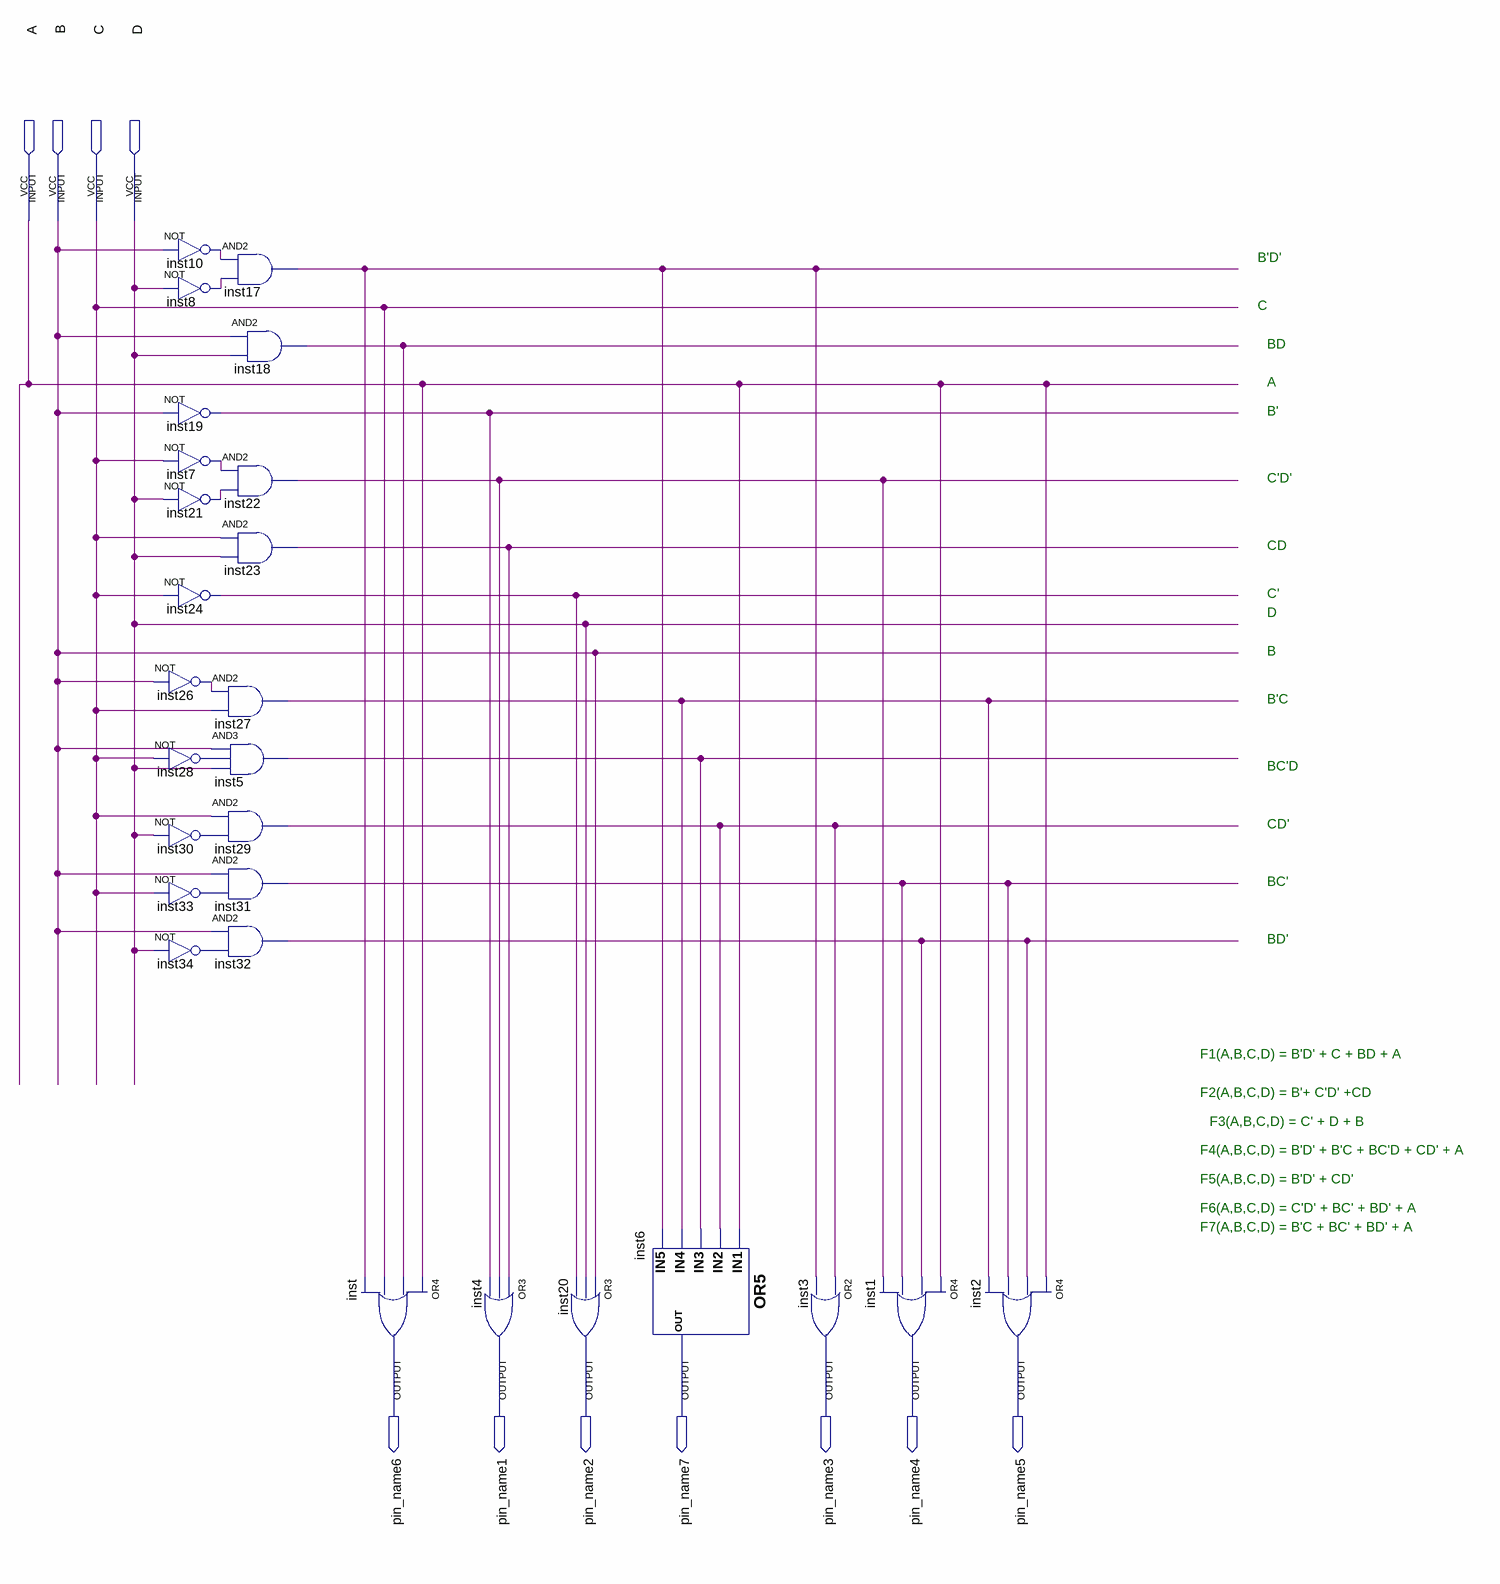
[diagram p0: schematic sheet]
// Quartus schematic lab1_7segment.bdf as structural Verilog: 27 symbols, 11 pins
module lab1_7segment (
  input  A,
  input  B,
  input  C,
  input  D,
  output pin_name6,
  output pin_name1,
  output pin_name2,
  output pin_name7,
  output pin_name3,
  output pin_name4,
  output pin_name5
);

  wire inst5_out, inst7_out, inst8_out, inst10_out, inst17_out, inst18_out, inst19_out, inst21_out,
       inst22_out, inst23_out, inst24_out, inst26_out, inst27_out, inst28_out, inst29_out, inst30_out,
       inst31_out, inst32_out, inst33_out, inst34_out;

  not inst10 (inst10_out, B);
  not inst8 (inst8_out, D);
  not inst19 (inst19_out, B);
  not inst7 (inst7_out, C);
  not inst21 (inst21_out, D);
  not inst24 (inst24_out, C);
  not inst26 (inst26_out, B);
  not inst28 (inst28_out, C);
  not inst30 (inst30_out, D);
  not inst33 (inst33_out, C);
  not inst34 (inst34_out, D);
  and inst17 (inst17_out, inst10_out, inst8_out);
  and inst18 (inst18_out, B, D);
  and inst22 (inst22_out, inst7_out, inst21_out);
  and inst23 (inst23_out, C, D);
  and inst27 (inst27_out, inst26_out, C);
  and inst5 (inst5_out, B, inst28_out, D);
  and inst29 (inst29_out, C, inst30_out);
  and inst31 (inst31_out, B, inst33_out);
  and inst32 (inst32_out, B, inst34_out);
  or inst (pin_name6, A, inst18_out, C, inst17_out);
  or inst4 (pin_name1, inst23_out, inst22_out, inst19_out);
  or inst20 (pin_name2, B, D, inst24_out);
  or inst6 (pin_name7, A, inst29_out, inst5_out, inst27_out, inst17_out);
  or inst3 (pin_name3, inst29_out, inst17_out);
  or inst1 (pin_name4, A, inst32_out, inst31_out, inst22_out);
  or inst2 (pin_name5, A, inst32_out, inst31_out, inst27_out);

  // Notes on the sheet:
  //   B'D'
  //   C
  //   BD
  //   A
  //   B'
  //   C'D'
  //   CD
  //   C'
  //   D
  //   B
  //   B'C
  //   BC'D
  //   CD'
  //   BC'
  //   BD'
  //   F1(A,B,C,D) = B'D' + C + BD + A
  //   F2(A,B,C,D) = B'+ C'D' +CD
  //   F3(A,B,C,D) = C' + D + B
  //   F4(A,B,C,D) = B'D' + B'C + BC'D + CD' + A
  //   F5(A,B,C,D) = B'D' + CD'
  //   F6(A,B,C,D) = C'D' + BC' + BD' + A
  //   F7(A,B,C,D) = B'C + BC' + BD' + A
endmodule
